# EasyEDA schematic LcsNodes-Building-Block-Extension-Logic.json
TITLE: Extenson Board - Connect Logic; REV: B.00.01; Date: 2023-05-28; Sheet: 1/1; Drawn By: helmut-f; Company: Your Company
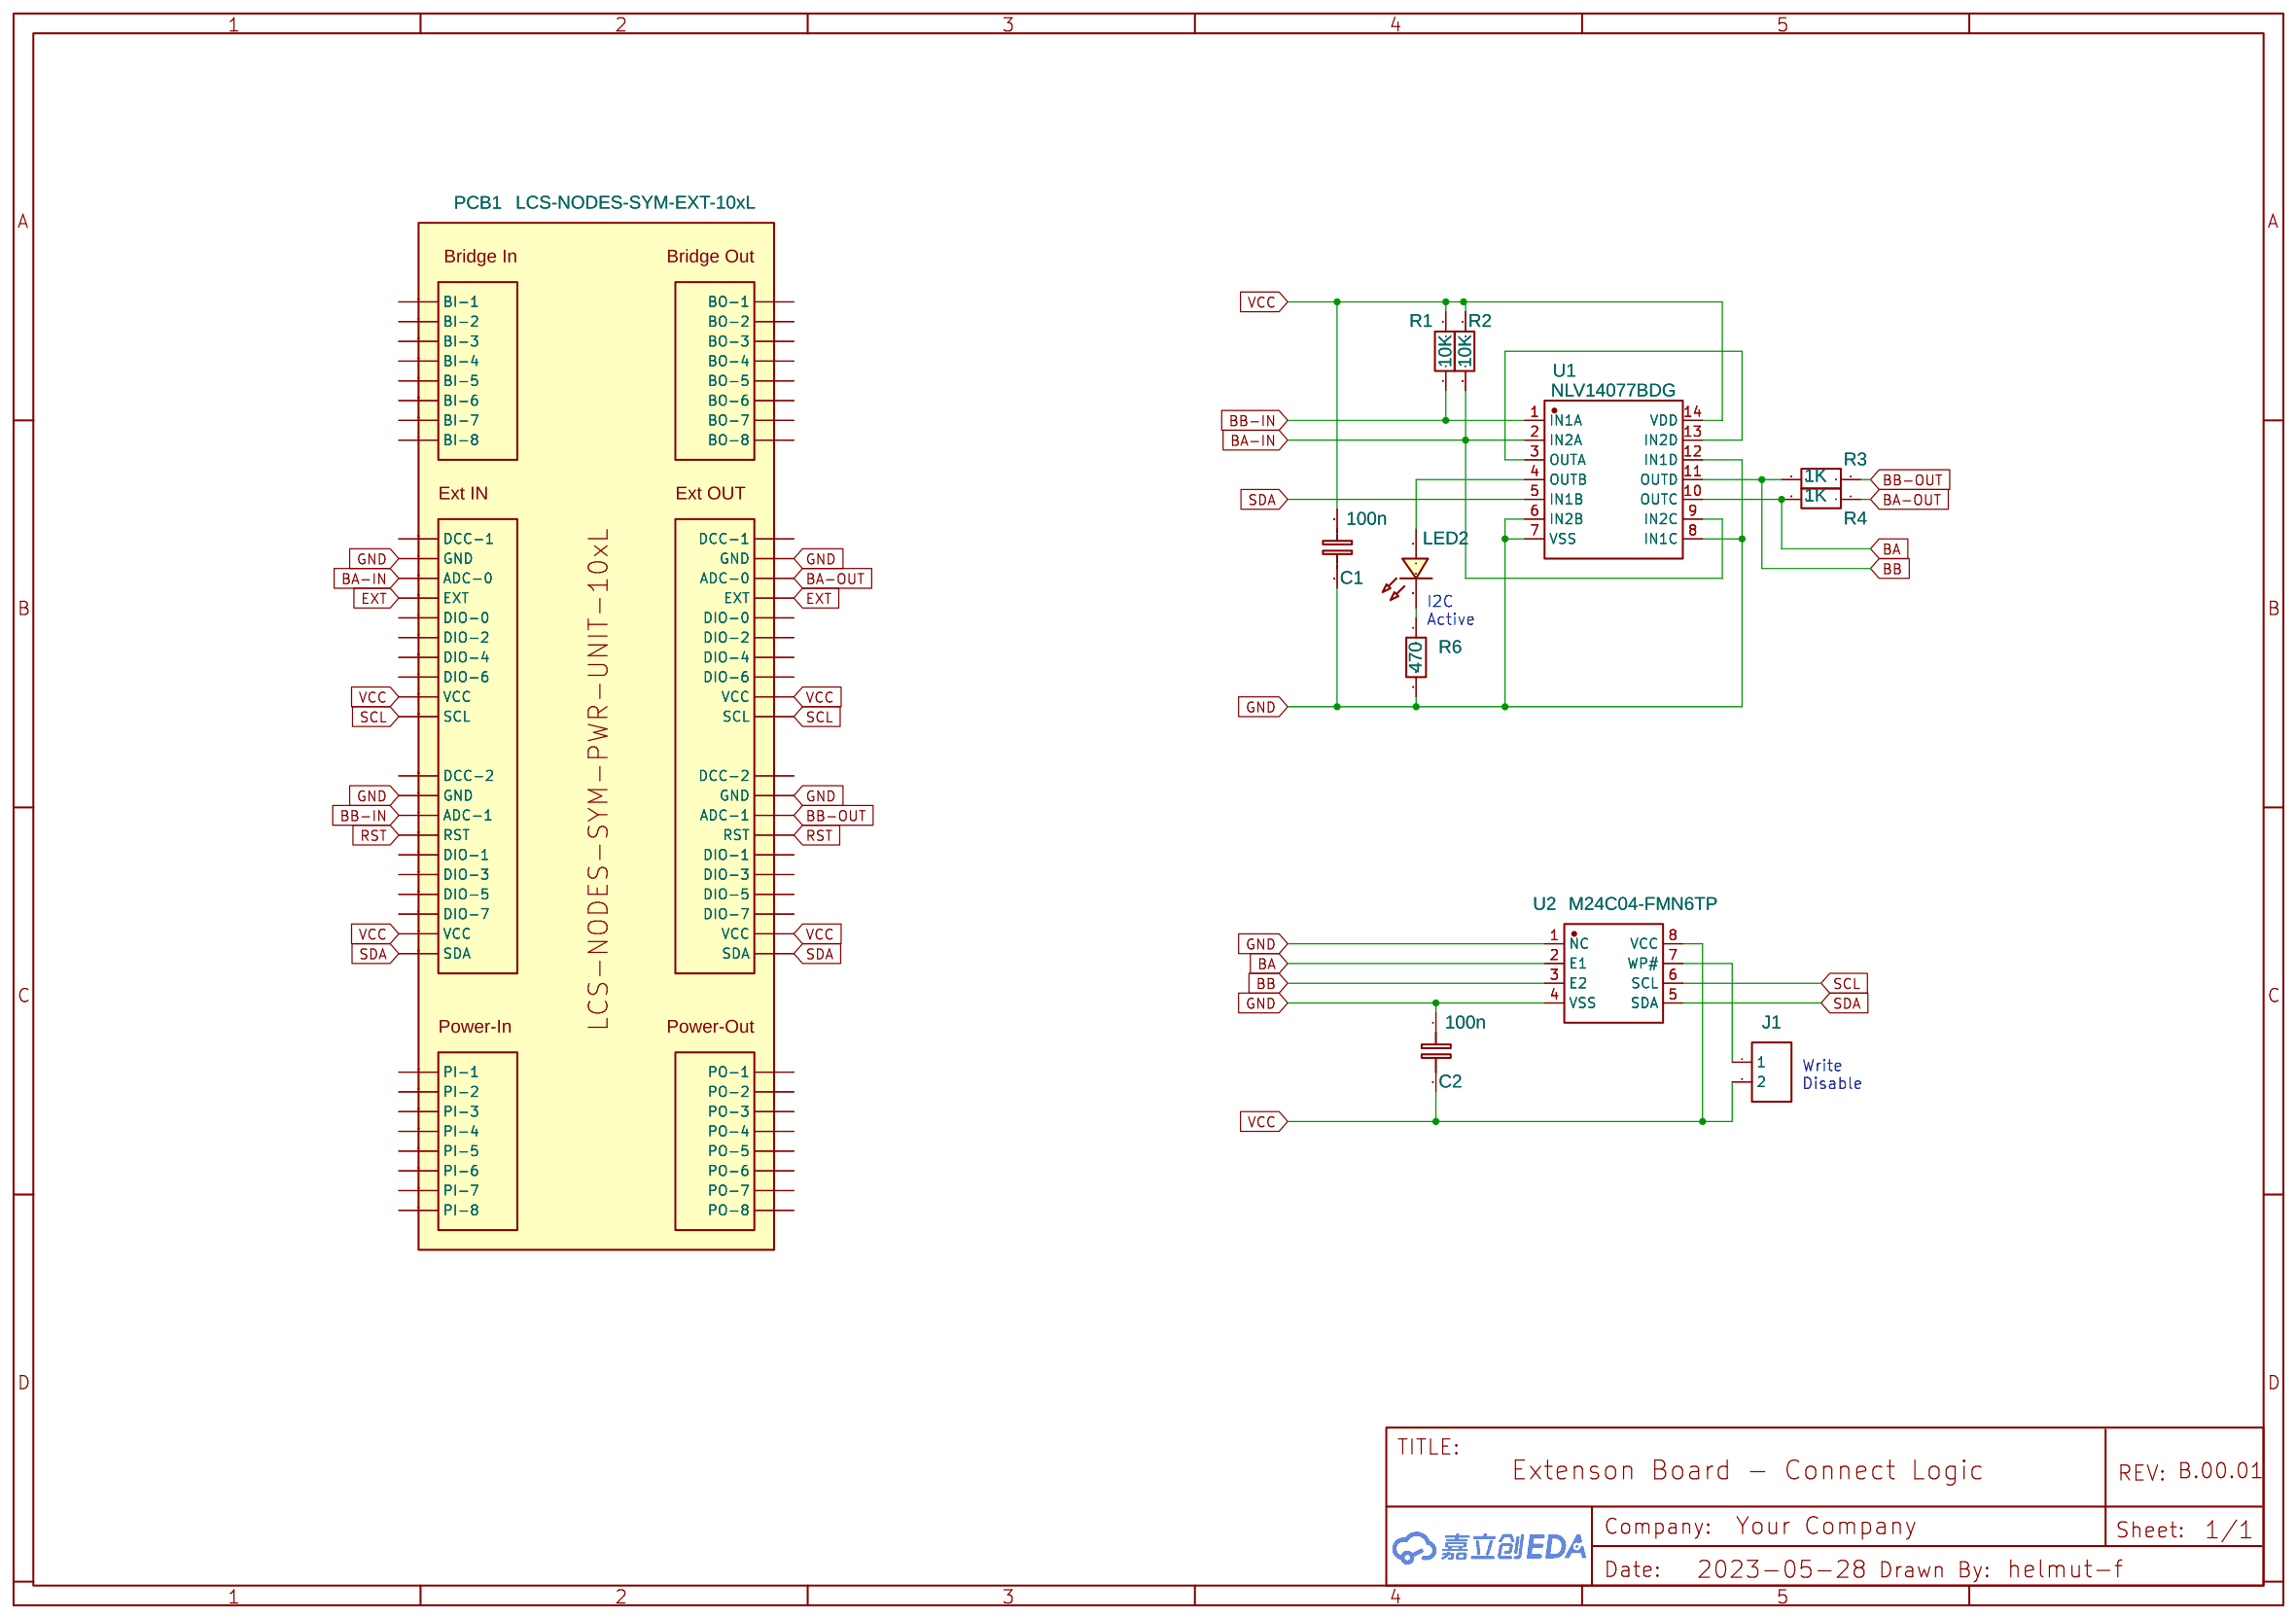
[diagram p0: schematic sheet]

## Parts
C1  100n  [C1206]
C2  100n  [C1206]
J1  HDR-M-2.54_1x2  [HDR-M-2.54_1X2]
LED2  LED-0805_G  [LED-1206]
PCB1  LCS-NODES-SYM-EXT-10xL  [LCS-NODES-FP-EXT-PCB-10X12]
R1  10K  [R1206]
R2  10K  [R1206]
R3  1K  [R1206]
R4  1K  [R1206]
R6  470  [R1206]
U1  NLV14077BDG  [SOIC-14_L8.7-W3.9-P1.27-LS6.0-BL]
U2  M24C04-FMN6TP  [SOP-8_L5.0-W3.9-P1.27-LS6.0-BL]

## Library data of the parts
C1 C2 = C_0603_EU: Contributor: LCEDA_Lib; Package Display: No
J1 = HDR-M-2.54_1x2: Supplier Part: C124375; Supplier: LCSC; Contributor: LCEDA_Lib
LED2 = LED-0805_G: Manufacturer: 国星光电; Manufacturer Part: NCD0805G1; Supplier Part: C84260; Contributor: LCEDA_Lib
PCB1 = LCS-NODES-SYM-EXT-10X8: Contributor: helmut-f
R1-R4 = R_AXIAL-0.3_EU: Contributor: LCEDA_Lib
R6 = R_0805_EU: Contributor: LCEDA_Lib
U1 = NLV14077BDG: Supplier: LCSC; Supplier Part: C897321; Manufacturer: onsemi(安森美); Contributor: LCSC; JLCPCB Part Class: Extended Part
U2 = M24C04-FMN6TP: Supplier: LCSC; Supplier Part: C2062025; Manufacturer: ST(意法半导体); Contributor: LCSC; JLCPCB Part Class: Extended Part

## Nets
GND: C1.2 C2.1 PCB1.21(GND) PCB1.31(GND) PCB1.61(GND) PCB1.71(GND) R6.2 U1.6(IN2B) U1.7(VSS) U1.8(IN1C) U1.12(IN1D) U2.1(NC) U2.4(VSS)
VCC: C1.1 C2.2 J1.2 PCB1.28(VCC) PCB1.38(VCC) PCB1.68(VCC) PCB1.78(VCC) R1.1 R2.1 U1.14(VDD) U2.8(VCC)
BA: R4.2 U1.10(OUTC) U2.2(E1)
BA-IN: PCB1.22(ADC-0) R2.2 U1.2(IN2A) U1.9(IN2C)
BA-OUT: PCB1.62(ADC-0) R4.1
BB: R3.2 U1.11(OUTD) U2.3(E2)
BB-IN: PCB1.32(ADC-1) R1.2 U1.1(IN1A)
BB-OUT: PCB1.72(ADC-1) R3.1
EXT: PCB1.23(EXT) PCB1.63(EXT)
RST: PCB1.33(RST) PCB1.73(RST)
SCL: PCB1.29(SCL) PCB1.69(SCL) U2.6(SCL)
SDA: PCB1.39(SDA) PCB1.79(SDA) U1.5(IN1B) U2.5(SDA)
Net-(J1-1): J1.1 U2.7(WP#)
Net-(LED2-1): LED2.1 U1.4(OUTB)
Net-(LED2-2): LED2.2 R6.1
Net-(U1-3): U1.3(OUTA) U1.13(IN2D)

Not connected (* = marked no-connect by the designer): PCB1 10(BI-1) 11(BI-2) 12(BI-3) 13(BI-4) 14(BI-5) 15(BI-6) 16(BI-7) 17(BI-8) 20(DCC-1) 24(DIO-0) 25(DIO-2) 26(DIO-4) 27(DIO-6) 30(DCC-2) 34(DIO-1) 35(DIO-3) 36(DIO-5) 37(DIO-7) 40(PI-1) 41(PI-2) 42(PI-3) 43(PI-4) 44(PI-5) 45(PI-6) 46(PI-7) 47(PI-8) 50(BO-1) 51(BO-2) 52(BO-3) 53(BO-4) 54(BO-5) 55(BO-6) 56(BO-7) 57(BO-8) 60(DCC-1) 64(DIO-0) 65(DIO-2) 66(DIO-4) 67(DIO-6) 70(DCC-2) 74(DIO-1) 75(DIO-3) 76(DIO-5) 77(DIO-7) 80(PO-1) 81(PO-2) 82(PO-3) 83(PO-4) 84(PO-5) 85(PO-6) 86(PO-7) 87(PO-8)

## Notes on the sheet
- I2C
  Active
- Write
  Disable
